# EAGLE schematic dotflipper (EAGLE 9.1.1)

## Sheet 1 of 2
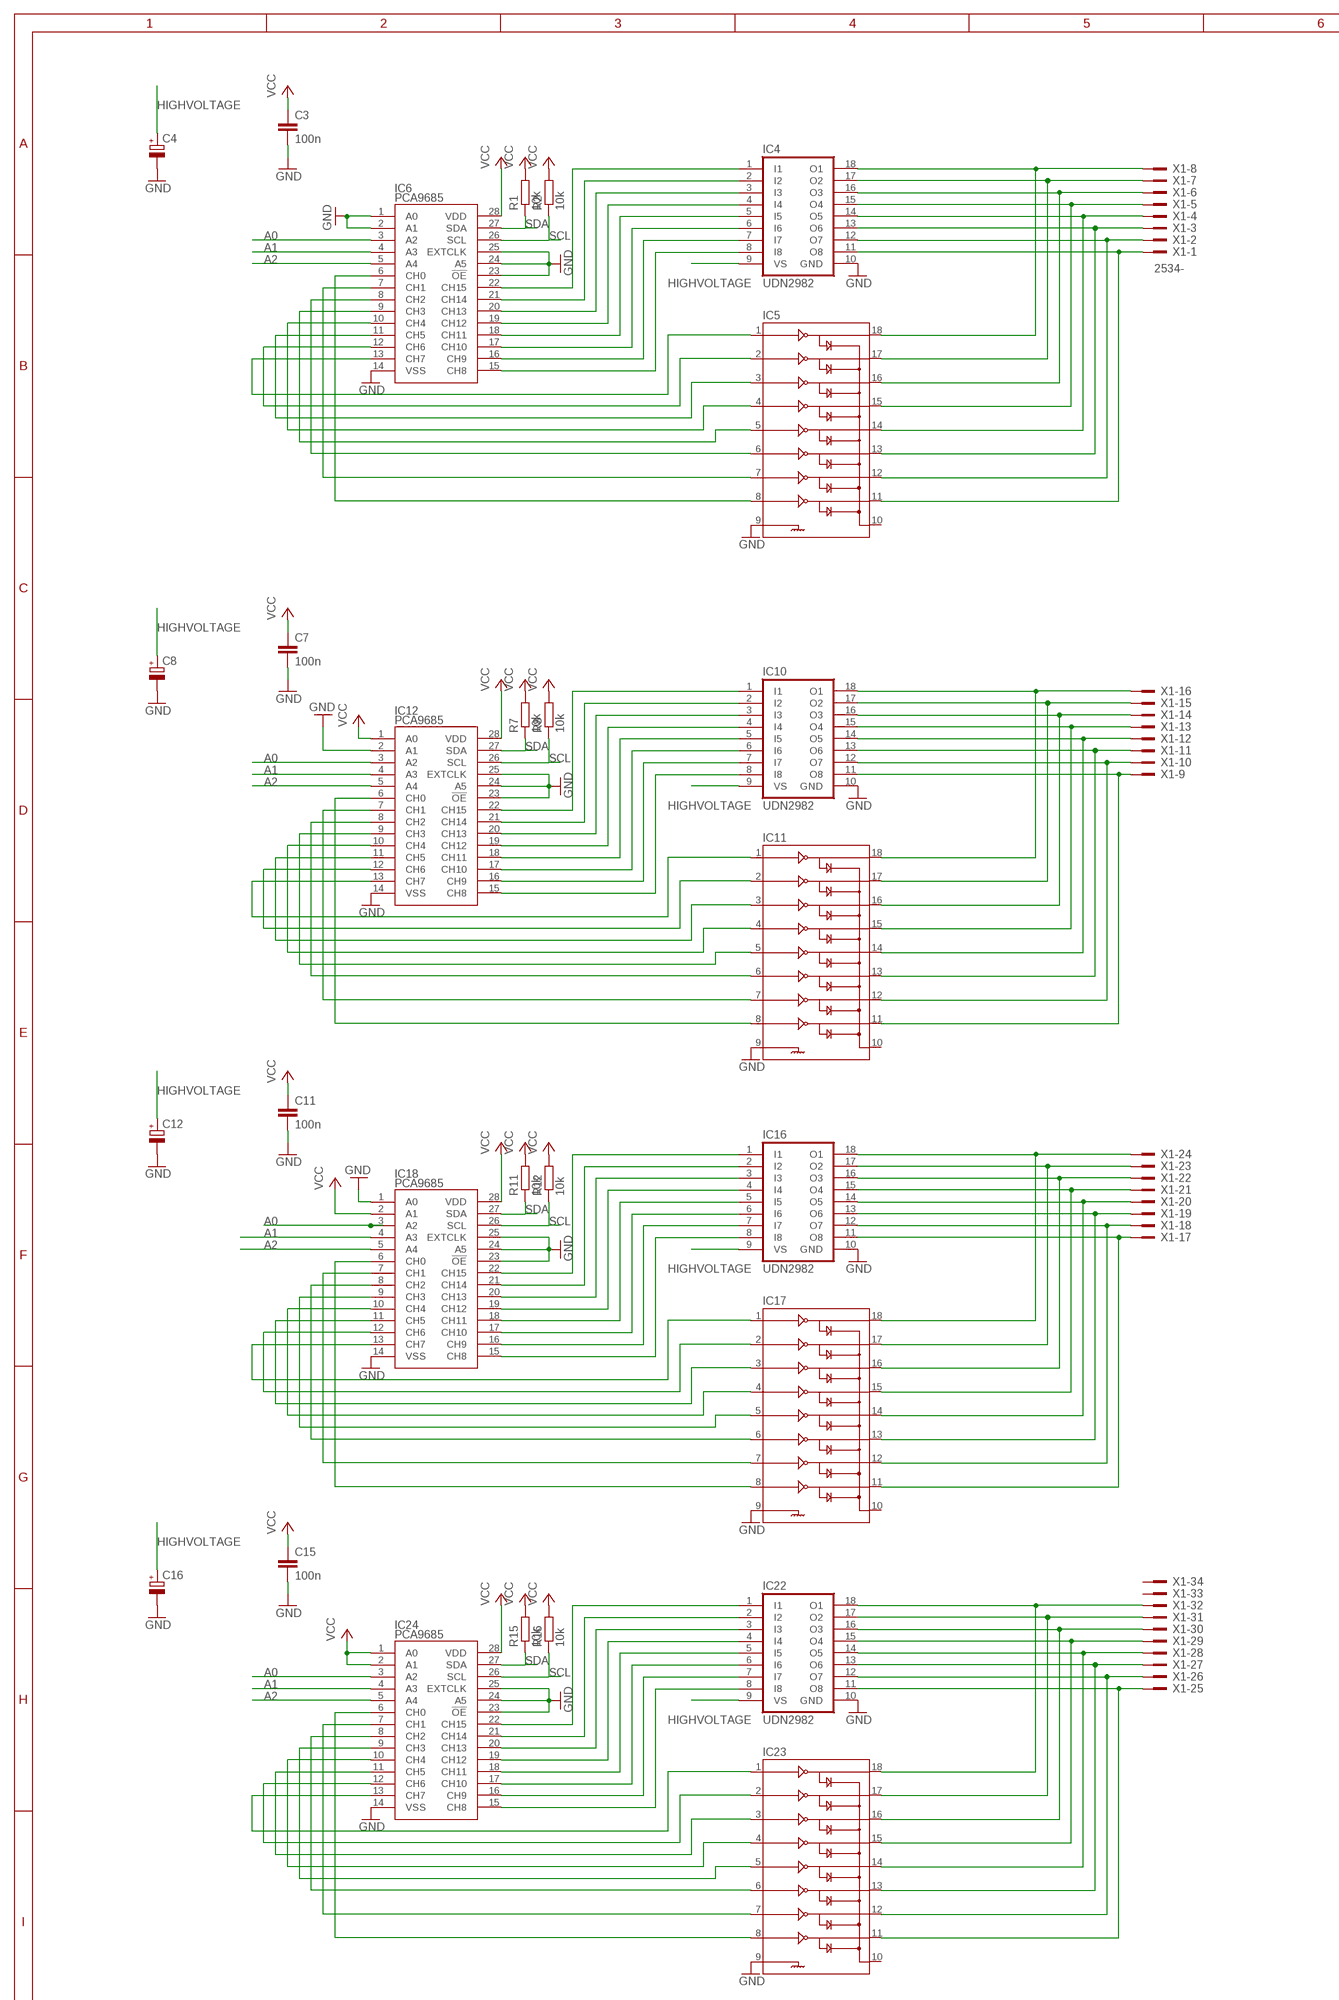
[diagram p0: schematic, sheet 1, part 1 of 2]
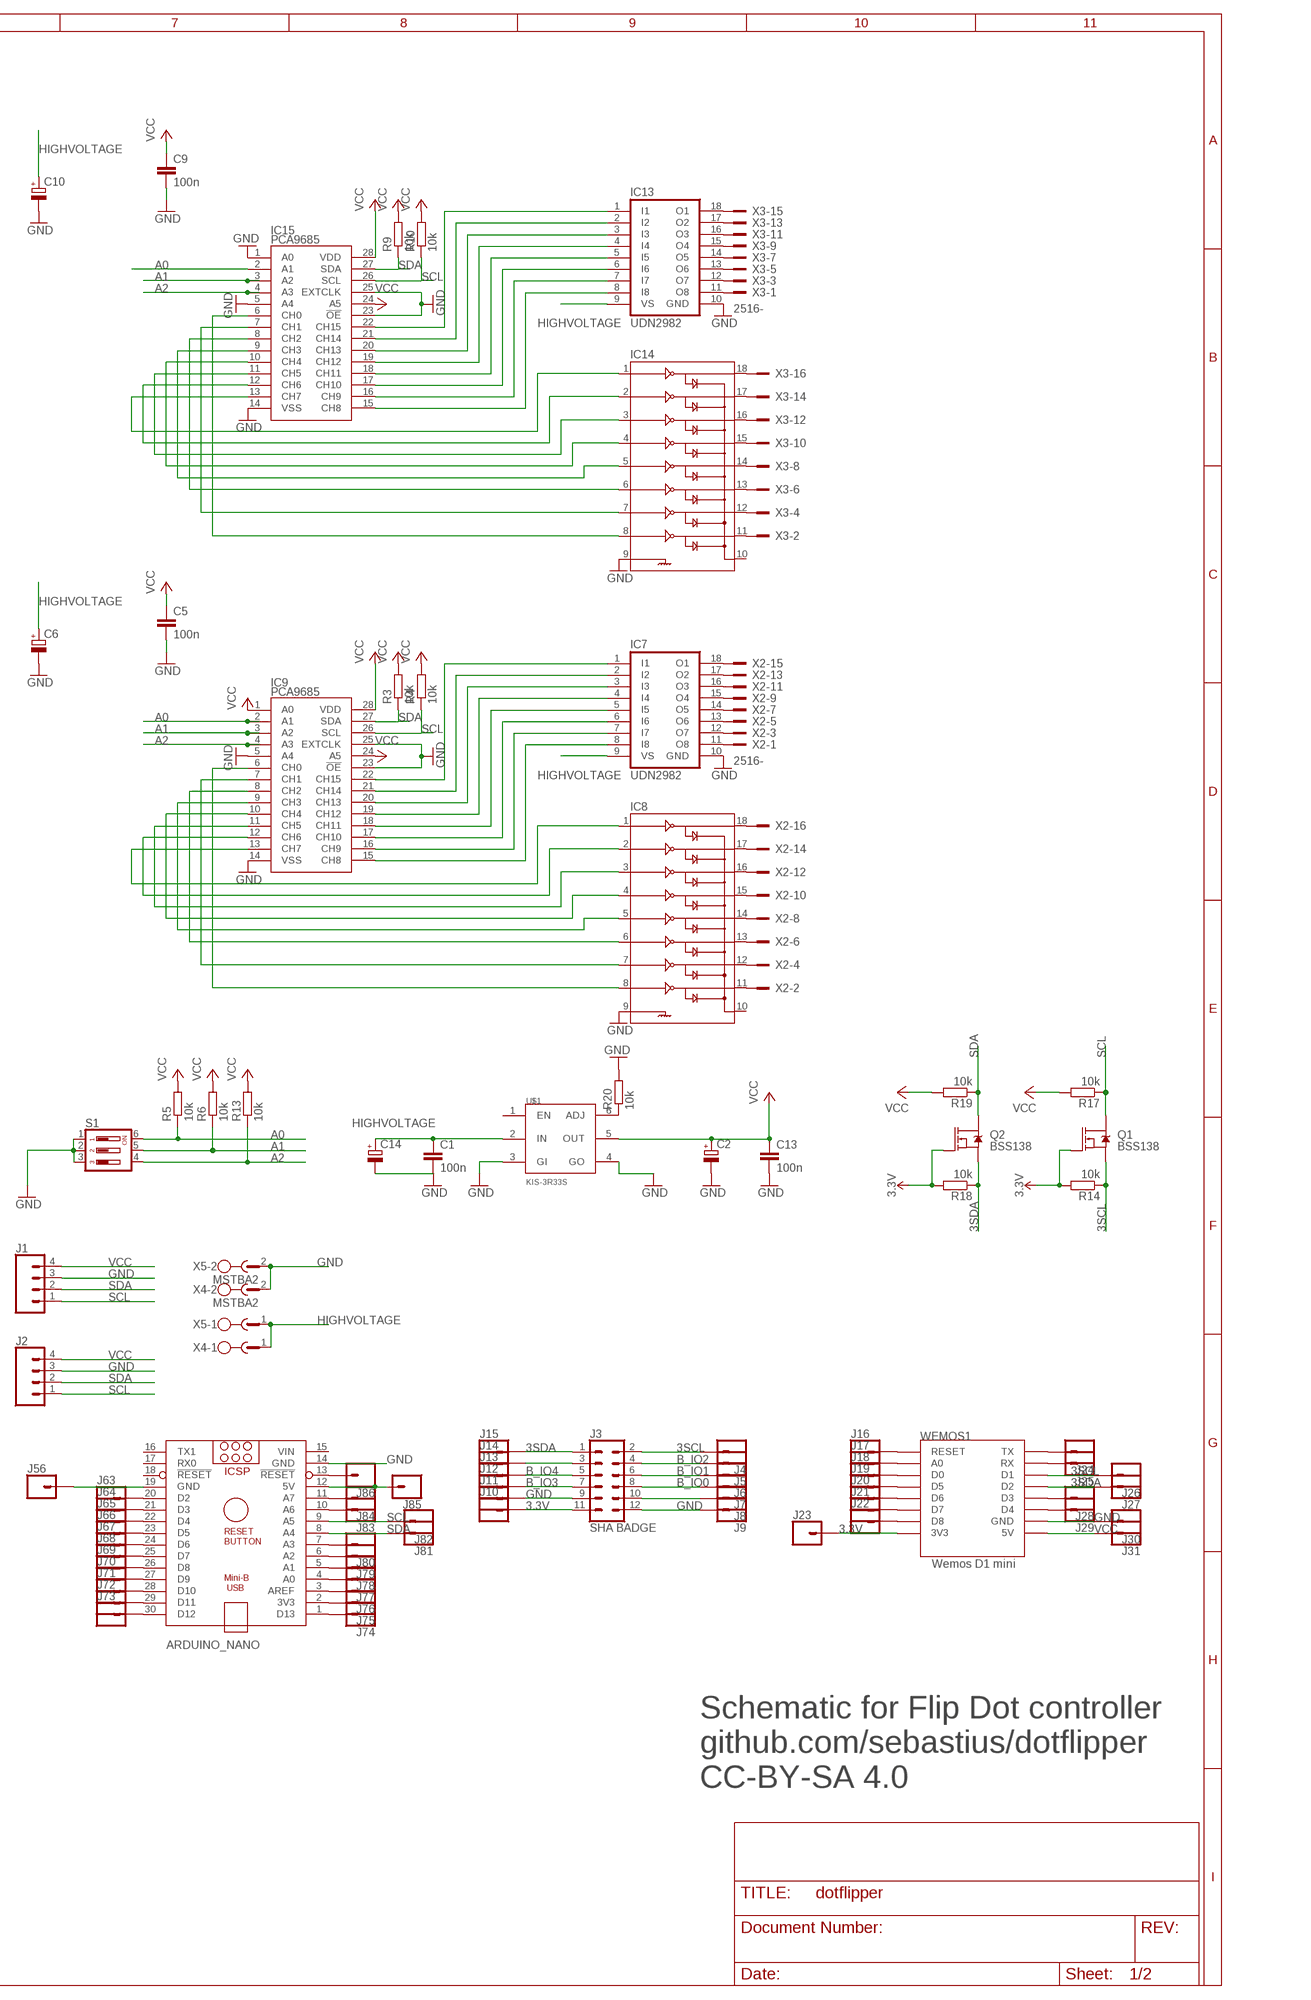
[diagram p1: schematic, sheet 1, part 2 of 2]

### Parts
ARDUINO_NANO  ARDUINO_NANO  [ARDUINO_NANO]
C1  100n  C-EUC0603  [C0603]
C2  CPOL-EUSANYO_SMD_F8  [SANYO-OSCON_SMD_F8]
C3  100n  C-EUC0603  [C0603]
C4  CPOL-EUE2.5-6  [E2,5-6]
C5  100n  C-EUC0603  [C0603]
C6  CPOL-EUE2.5-6  [E2,5-6]
C7  100n  C-EUC0603  [C0603]
C8  CPOL-EUE2.5-6  [E2,5-6]
C9  100n  C-EUC0603  [C0603]
C10  CPOL-EUE2.5-6  [E2,5-6]
C11  100n  C-EUC0603  [C0603]
C12  CPOL-EUE2.5-6  [E2,5-6]
C13  100n  C-EUC0603  [C0603]
C14  CPOL-EUSANYO_SMD_F8  [SANYO-OSCON_SMD_F8]
C15  100n  C-EUC0603  [C0603]
C16  CPOL-EUE2.5-6  [E2,5-6]
IC4  UDN2982  UDN2981A  [DIL18]
IC5  ULN2803DIP  [DIL18]
IC6  PCA9685  [TSSOP-28_4MM]
IC7  UDN2982  UDN2981A  [DIL18]
IC8  ULN2803DIP  [DIL18]
IC9  PCA9685  [TSSOP-28_4MM]
IC10  UDN2982  UDN2981A  [DIL18]
IC11  ULN2803DIP  [DIL18]
IC12  PCA9685  [TSSOP-28_4MM]
IC13  UDN2982  UDN2981A  [DIL18]
IC14  ULN2803DIP  [DIL18]
IC15  PCA9685  [TSSOP-28_4MM]
IC16  UDN2982  UDN2981A  [DIL18]
IC17  ULN2803DIP  [DIL18]
IC18  PCA9685  [TSSOP-28_4MM]
IC22  UDN2982  UDN2981A  [DIL18]
IC23  ULN2803DIP  [DIL18]
IC24  PCA9685  [TSSOP-28_4MM]
J1  CONN_04  [1X04]
J2  CONN_04  [1X04]
J3  SHA BADGE  CONN_06X2PTH_FEMALE  [2X6]
J4  CONN_01  [1X01]
J5  CONN_01  [1X01]
J6  CONN_01  [1X01]
J7  CONN_01  [1X01]
J8  CONN_01  [1X01]
J9  CONN_01  [1X01]
J10  CONN_01  [1X01]
J11  CONN_01  [1X01]
J12  CONN_01  [1X01]
J13  CONN_01  [1X01]
J14  CONN_01  [1X01]
J15  CONN_01  [1X01]
J16  CONN_01  [1X01]
J17  CONN_01  [1X01]
J18  CONN_01  [1X01]
J19  CONN_01  [1X01]
J20  CONN_01  [1X01]
J21  CONN_01  [1X01]
J22  CONN_01  [1X01]
J23  CONN_01  [1X01]
J24  CONN_01  [1X01]
J25  CONN_01  [1X01]
J26  CONN_01  [1X01]
J27  CONN_01  [1X01]
J28  CONN_01  [1X01]
J29  CONN_01  [1X01]
J30  CONN_01  [1X01]
J31  CONN_01  [1X01]
J56  CONN_01  [1X01]
J63  CONN_01  [1X01]
J64  CONN_01  [1X01]
J65  CONN_01  [1X01]
J66  CONN_01  [1X01]
J67  CONN_01  [1X01]
J68  CONN_01  [1X01]
J69  CONN_01  [1X01]
J70  CONN_01  [1X01]
J71  CONN_01  [1X01]
J72  CONN_01  [1X01]
J73  CONN_01  [1X01]
J74  CONN_01  [1X01]
J75  CONN_01  [1X01]
J76  CONN_01  [1X01]
J77  CONN_01  [1X01]
J78  CONN_01  [1X01]
J79  CONN_01  [1X01]
J80  CONN_01  [1X01]
J81  CONN_01  [1X01]
J82  CONN_01  [1X01]
J83  CONN_01  [1X01]
J84  CONN_01  [1X01]
J85  CONN_01  [1X01]
J86  CONN_01  [1X01]
Q1  BSS138  MOSFET-NCH-BSS138  [SOT23-3]
Q2  BSS138  MOSFET-NCH-BSS138  [SOT23-3]
R1  10k  R-EU_R0603  [R0603]
R2  10k  R-EU_R0603  [R0603]
R3  10k  R-EU_R0603  [R0603]
R4  10k  R-EU_R0603  [R0603]
R5  10k  R-EU_R0603  [R0603]
R6  10k  R-EU_R0603  [R0603]
R7  10k  R-EU_R0603  [R0603]
R8  10k  R-EU_R0603  [R0603]
R9  10k  R-EU_R0603  [R0603]
R10  10k  R-EU_R0603  [R0603]
R11  10k  R-EU_R0603  [R0603]
R12  10k  R-EU_R0603  [R0603]
R13  10k  R-EU_R0603  [R0603]
R14  10k  R-EU_R0603  [R0603]
R15  10k  R-EU_R0603  [R0603]
R16  10k  R-EU_R0603  [R0603]
R17  10k  R-EU_R0603  [R0603]
R18  10k  R-EU_R0603  [R0603]
R19  10k  R-EU_R0603  [R0603]
R20  10k  R-EU_R0603  [R0603]
S1  DIP03YL  [DIP03YL]
U$1  KIS-3R33S  [KIS-3R33S]
WEMOS1  Wemos D1 mini  WEMOS-D1-MINI  [WEMOS-D1-MINI]
X1  2534-  [PAK100/2500-34]
X2  2516-  [PAK100/2500-16]
X3  2516-  [PAK100/2500-16]
X4  MSTBA2  [MSTBA2]
X5  MSTBA2  [MSTBA2]

### Nets
3.3V: J3.11 J10.1 J23.1 Q1.1(G) Q2.1(G) R14.2 R18.2 WEMOS1.3V3
3SCL: J3.2 J4.1 J26.1 Q1.2(S) R14.1 WEMOS1.D1
3SDA: J3.1 J15.1 J27.1 Q2.2(S) R18.1 WEMOS1.D2
A0: IC6.3(A2) IC9.2(A1) IC12.3(A2) IC15.2(A1) IC18.3(A2) IC24.3(A2) R5.1 S1.6
A1: IC6.4(A3) IC9.3(A2) IC12.4(A3) IC15.3(A2) IC18.4(A3) IC24.4(A3) R6.1 S1.5
A2: IC6.5(A4) IC9.4(A3) IC12.5(A4) IC15.4(A3) IC18.5(A4) IC24.5(A4) R13.1 S1.4
B_IO0: J3.8 J7.1
B_IO1: J3.6 J6.1
B_IO2: J3.4 J5.1
B_IO3: J3.7 J12.1
B_IO4: J3.5 J13.1
GND: ARDUINO_NANO.14(GND) ARDUINO_NANO.19(GND) C1.2 C2.- C3.2 C4.- C5.2 C6.- C7.2 C8.- C9.2 C10.- C11.2 C12.- C13.2 C14.- C15.2 C16.- IC4.10(GND) IC5.9 IC6.1(A0) IC6.2(A1) IC6.14(VSS) IC6.23(!OE) IC6.24(A5) IC6.25(EXTCLK) IC7.10(GND) IC8.9 IC9.5(A4) IC9.14(VSS) IC9.23(!OE) IC9.25(EXTCLK) IC10.10(GND) IC11.9 IC12.2(A1) IC12.14(VSS) IC12.23(!OE) IC12.24(A5) IC12.25(EXTCLK) IC13.10(GND) IC14.9 IC15.1(A0) IC15.5(A4) IC15.14(VSS) IC15.23(!OE) IC15.25(EXTCLK) IC16.10(GND) IC17.9 IC18.1(A0) IC18.14(VSS) IC18.23(!OE) IC18.24(A5) IC18.25(EXTCLK) IC22.10(GND) IC23.9 IC24.14(VSS) IC24.23(!OE) IC24.24(A5) IC24.25(EXTCLK) J1.3 J2.3 J3.9 J3.12 J9.1 J11.1 J30.1 J56.1 R20.2 S1.1 S1.2 S1.3 U$1.3(GI) U$1.4(GO) WEMOS1.GND X4.2 X5.2
HIGHVOLTAGE: C1.1 C4.+ C6.+ C8.+ C10.+ C12.+ C14.+ C16.+ IC4.9(VS) IC7.9(VS) IC10.9(VS) IC13.9(VS) IC16.9(VS) IC22.9(VS) U$1.2(IN) X4.1 X5.1
N$1: IC4.1(I1) IC6.22(CH15)
N$2: IC4.2(I2) IC6.21(CH14)
N$3: IC4.3(I3) IC6.20(CH13)
N$4: IC4.4(I4) IC6.19(CH12)
N$5: IC7.11(O8) X2.1
N$6: IC4.5(I5) IC6.18(CH11)
N$7: IC8.11 X2.2
N$8: IC7.12(O7) X2.3
N$9: IC8.12 X2.4
N$10: IC7.13(O6) X2.5
N$11: IC7.14(O5) X2.7
N$12: IC7.15(O4) X2.9
N$13: IC7.16(O3) X2.11
N$14: IC7.17(O2) X2.13
N$15: IC7.18(O1) X2.15
N$16: IC8.13 X2.6
N$17: IC4.6(I6) IC6.17(CH10)
N$18: IC4.7(I7) IC6.16(CH9)
N$19: IC8.14 X2.8
N$20: IC4.8(I8) IC6.15(CH8)
N$21: IC5.4 IC6.10(CH4)
N$22: IC8.15 X2.10
N$23: IC8.16 X2.12
N$24: IC8.17 X2.14
N$25: IC5.6 IC6.8(CH2)
N$26: IC5.7 IC6.7(CH1)
N$27: IC8.18 X2.16
N$28: IC5.8 IC6.6(CH0)
N$29: IC5.2 IC6.12(CH6)
N$30: IC5.3 IC6.11(CH5)
N$31: IC5.5 IC6.9(CH3)
N$32: IC5.1 IC6.13(CH7)
N$33: IC13.11(O8) X3.1
N$34: IC4.12(O7) IC5.12 X1.2
N$35: IC13.12(O7) X3.3
N$36: IC4.14(O5) IC5.14 X1.4
N$37: IC13.13(O6) X3.5
N$38: IC4.16(O3) IC5.16 X1.6
N$39: IC13.14(O5) X3.7
N$40: IC13.15(O4) X3.9
N$41: IC4.18(O1) IC5.18 X1.8
N$42: IC13.16(O3) X3.11
N$43: IC4.11(O8) IC5.11 X1.1
N$44: IC13.17(O2) X3.13
N$45: IC4.13(O6) IC5.13 X1.3
N$46: IC13.18(O1) X3.15
N$47: IC4.15(O4) IC5.15 X1.5
N$48: IC4.17(O2) IC5.17 X1.7
N$49: IC7.1(I1) IC9.22(CH15)
N$50: IC7.2(I2) IC9.21(CH14)
N$51: IC7.3(I3) IC9.20(CH13)
N$52: IC7.4(I4) IC9.19(CH12)
N$53: IC7.5(I5) IC9.18(CH11)
N$54: IC7.6(I6) IC9.17(CH10)
N$55: IC7.7(I7) IC9.16(CH9)
N$56: IC7.8(I8) IC9.15(CH8)
N$57: IC8.4 IC9.10(CH4)
N$58: IC8.6 IC9.8(CH2)
N$59: IC8.7 IC9.7(CH1)
N$60: IC8.8 IC9.6(CH0)
N$61: IC8.2 IC9.12(CH6)
N$62: IC8.3 IC9.11(CH5)
N$63: IC8.5 IC9.9(CH3)
N$64: IC8.1 IC9.13(CH7)
N$65: IC14.11 X3.2
N$66: IC14.12 X3.4
N$67: IC14.13 X3.6
N$68: IC14.14 X3.8
N$69: IC14.15 X3.10
N$70: IC14.16 X3.12
N$71: IC14.17 X3.14
N$72: IC14.18 X3.16
N$73: IC10.1(I1) IC12.22(CH15)
N$74: IC10.2(I2) IC12.21(CH14)
N$75: IC10.3(I3) IC12.20(CH13)
N$76: IC10.4(I4) IC12.19(CH12)
N$77: IC10.5(I5) IC12.18(CH11)
N$78: IC10.6(I6) IC12.17(CH10)
N$79: IC10.7(I7) IC12.16(CH9)
N$80: IC10.8(I8) IC12.15(CH8)
N$81: IC11.4 IC12.10(CH4)
N$82: IC11.6 IC12.8(CH2)
N$83: IC11.7 IC12.7(CH1)
N$84: IC11.8 IC12.6(CH0)
N$85: IC11.2 IC12.12(CH6)
N$86: IC11.3 IC12.11(CH5)
N$87: IC11.5 IC12.9(CH3)
N$88: IC11.1 IC12.13(CH7)
N$89: IC10.12(O7) IC11.12 X1.10
N$90: IC10.14(O5) IC11.14 X1.12
N$91: IC10.16(O3) IC11.16 X1.14
N$92: IC10.18(O1) IC11.18 X1.16
N$93: IC10.11(O8) IC11.11 X1.9
N$94: IC10.13(O6) IC11.13 X1.11
N$95: IC10.15(O4) IC11.15 X1.13
N$96: IC10.17(O2) IC11.17 X1.15
N$97: J16.1 WEMOS1.RESET
N$98: J17.1 WEMOS1.A0
N$99: J3.3 J14.1
N$100: R20.1 U$1.6(ADJ)
N$101: J18.1 WEMOS1.D0
N$102: J19.1 WEMOS1.D5
N$103: J20.1 WEMOS1.D6
N$104: J21.1 WEMOS1.D7
N$105: IC13.1(I1) IC15.22(CH15)
N$106: IC13.2(I2) IC15.21(CH14)
N$107: IC13.3(I3) IC15.20(CH13)
N$108: IC13.4(I4) IC15.19(CH12)
N$109: IC13.5(I5) IC15.18(CH11)
N$110: IC13.6(I6) IC15.17(CH10)
N$111: IC13.7(I7) IC15.16(CH9)
N$112: IC13.8(I8) IC15.15(CH8)
N$113: IC14.4 IC15.10(CH4)
N$114: IC14.6 IC15.8(CH2)
N$115: IC14.7 IC15.7(CH1)
N$116: IC14.8 IC15.6(CH0)
N$117: IC14.2 IC15.12(CH6)
N$118: IC14.3 IC15.11(CH5)
N$119: IC14.5 IC15.9(CH3)
N$120: IC14.1 IC15.13(CH7)
N$121: IC16.1(I1) IC18.22(CH15)
N$122: IC16.2(I2) IC18.21(CH14)
N$123: IC16.3(I3) IC18.20(CH13)
N$124: IC16.4(I4) IC18.19(CH12)
N$125: IC16.5(I5) IC18.18(CH11)
N$126: IC16.6(I6) IC18.17(CH10)
N$127: IC16.7(I7) IC18.16(CH9)
N$128: IC16.8(I8) IC18.15(CH8)
N$129: IC17.4 IC18.10(CH4)
N$130: IC17.6 IC18.8(CH2)
N$131: IC17.7 IC18.7(CH1)
N$132: IC17.8 IC18.6(CH0)
N$133: IC17.2 IC18.12(CH6)
N$134: IC17.3 IC18.11(CH5)
N$135: IC17.5 IC18.9(CH3)
N$136: IC17.1 IC18.13(CH7)
N$137: IC16.12(O7) IC17.12 X1.18
N$138: IC16.14(O5) IC17.14 X1.20
N$139: IC16.16(O3) IC17.16 X1.22
N$140: IC16.18(O1) IC17.18 X1.24
N$141: IC16.11(O8) IC17.11 X1.17
N$142: IC16.13(O6) IC17.13 X1.19
N$143: IC16.15(O4) IC17.15 X1.21
N$144: IC16.17(O2) IC17.17 X1.23
N$145: J22.1 WEMOS1.D8
N$146: J24.1 WEMOS1.TX
N$147: J3.10 J8.1
N$148: J25.1 WEMOS1.RX
N$149: J28.1 WEMOS1.D3
N$150: J29.1 WEMOS1.D4
N$152: ARDUINO_NANO.20(D2) J63.1
N$153: ARDUINO_NANO.21(D3) J64.1
N$154: ARDUINO_NANO.22(D4) J65.1
N$155: ARDUINO_NANO.23(D5) J66.1
N$156: ARDUINO_NANO.24(D6) J67.1
N$157: ARDUINO_NANO.25(D7) J68.1
N$158: ARDUINO_NANO.26(D8) J69.1
N$159: ARDUINO_NANO.27(D9) J70.1
N$160: ARDUINO_NANO.28(D10) J71.1
N$161: ARDUINO_NANO.29(D11) J72.1
N$162: ARDUINO_NANO.30(D12) J73.1
N$163: ARDUINO_NANO.1(D13) J74.1
N$164: ARDUINO_NANO.2(3V3) J75.1
N$165: ARDUINO_NANO.3(AREF) J76.1
N$166: ARDUINO_NANO.4(A0) J77.1
N$167: ARDUINO_NANO.5(A1) J78.1
N$168: ARDUINO_NANO.6(A2) J79.1
N$169: IC22.1(I1) IC24.22(CH15)
N$170: IC22.2(I2) IC24.21(CH14)
N$171: IC22.3(I3) IC24.20(CH13)
N$172: IC22.4(I4) IC24.19(CH12)
N$173: IC22.5(I5) IC24.18(CH11)
N$174: IC22.6(I6) IC24.17(CH10)
N$175: IC22.7(I7) IC24.16(CH9)
N$176: IC22.8(I8) IC24.15(CH8)
N$177: IC23.4 IC24.10(CH4)
N$178: IC23.6 IC24.8(CH2)
N$179: IC23.7 IC24.7(CH1)
N$180: IC23.8 IC24.6(CH0)
N$181: IC23.2 IC24.12(CH6)
N$182: IC23.3 IC24.11(CH5)
N$183: IC23.5 IC24.9(CH3)
N$184: IC23.1 IC24.13(CH7)
N$185: IC22.12(O7) IC23.12 X1.26
N$186: IC22.14(O5) IC23.14 X1.28
N$187: IC22.16(O3) IC23.16 X1.30
N$188: IC22.18(O1) IC23.18 X1.32
N$189: IC22.11(O8) IC23.11 X1.25
N$190: IC22.13(O6) IC23.13 X1.27
N$191: IC22.15(O4) IC23.15 X1.29
N$192: IC22.17(O2) IC23.17 X1.31
N$193: ARDUINO_NANO.7(A3) J80.1
N$194: ARDUINO_NANO.10(A6) J83.1
N$195: ARDUINO_NANO.11(A7) J84.1
N$196: ARDUINO_NANO.13(!RESET) J86.1
SCL: ARDUINO_NANO.9(A5) IC6.26(SCL) IC9.26(SCL) IC12.26(SCL) IC15.26(SCL) IC18.26(SCL) IC24.26(SCL) J1.1 J2.1 J82.1 Q1.3(D) R2.1 R4.1 R8.1 R10.1 R12.1 R16.1 R17.1
SDA: ARDUINO_NANO.8(A4) IC6.27(SDA) IC9.27(SDA) IC12.27(SDA) IC15.27(SDA) IC18.27(SDA) IC24.27(SDA) J1.2 J2.2 J81.1 Q2.3(D) R1.1 R3.1 R7.1 R9.1 R11.1 R15.1 R19.1
VCC: ARDUINO_NANO.12(5V) C2.+ C3.1 C5.1 C7.1 C9.1 C11.1 C13.1 C15.1 IC6.28(VDD) IC9.1(A0) IC9.24(A5) IC9.28(VDD) IC12.1(A0) IC12.28(VDD) IC15.24(A5) IC15.28(VDD) IC18.2(A1) IC18.28(VDD) IC24.1(A0) IC24.2(A1) IC24.28(VDD) J1.4 J2.4 J31.1 J85.1 R1.2 R2.2 R3.2 R4.2 R5.2 R6.2 R7.2 R8.2 R9.2 R10.2 R11.2 R12.2 R13.2 R15.2 R16.2 R17.2 R19.2 U$1.5(OUT) WEMOS1.5V
Unconnected: ARDUINO_NANO.16(TX1) ARDUINO_NANO.17(RX0) ARDUINO_NANO.18(!RESET) IC5.10 IC8.10 IC11.10 IC14.10 IC17.10 IC23.10 U$1.1(EN) X1.33 X1.34

### Notes on the sheet
- Schematic for Flip Dot controller
  github.com/sebastius/dotflipper
  CC-BY-SA 4.0

## Sheet 2 of 2
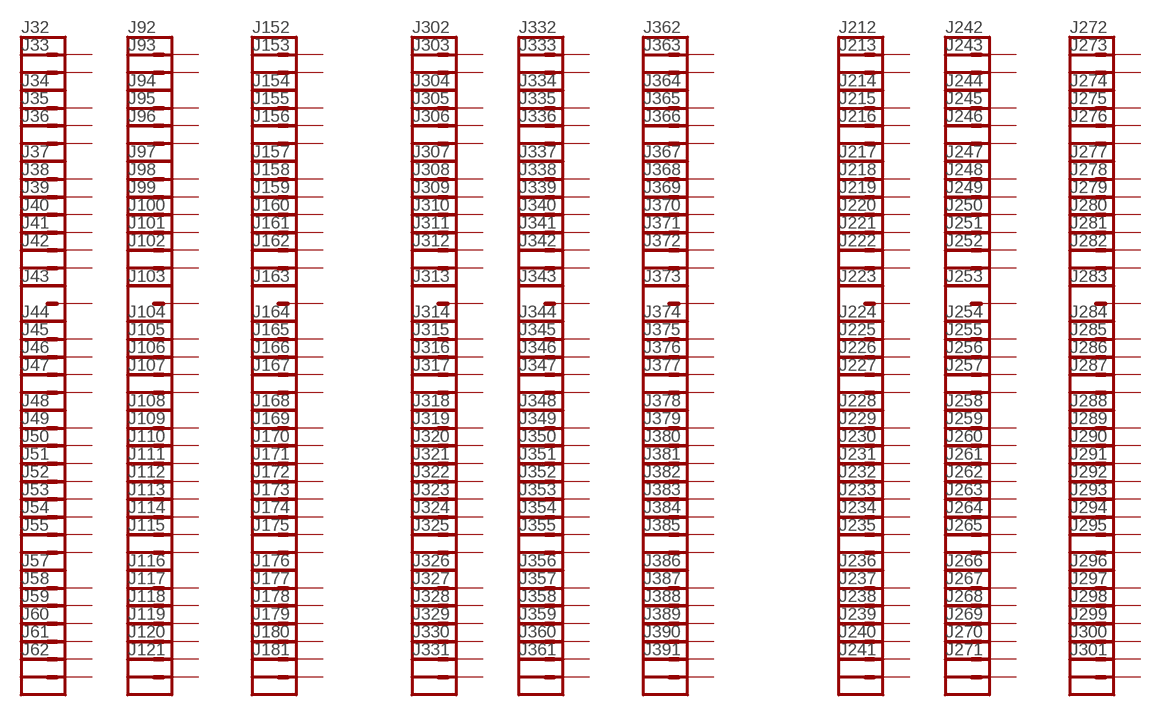
[diagram p2: schematic, sheet 2]

### Parts
J32  CONN_01  [1X01]
J33  CONN_01  [1X01]
J34  CONN_01  [1X01]
J35  CONN_01  [1X01]
J36  CONN_01  [1X01]
J37  CONN_01  [1X01]
J38  CONN_01  [1X01]
J39  CONN_01  [1X01]
J40  CONN_01  [1X01]
J41  CONN_01  [1X01]
J42  CONN_01  [1X01]
J43  CONN_01  [1X01]
J44  CONN_01  [1X01]
J45  CONN_01  [1X01]
J46  CONN_01  [1X01]
J47  CONN_01  [1X01]
J48  CONN_01  [1X01]
J49  CONN_01  [1X01]
J50  CONN_01  [1X01]
J51  CONN_01  [1X01]
J52  CONN_01  [1X01]
J53  CONN_01  [1X01]
J54  CONN_01  [1X01]
J55  CONN_01  [1X01]
J57  CONN_01  [1X01]
J58  CONN_01  [1X01]
J59  CONN_01  [1X01]
J60  CONN_01  [1X01]
J61  CONN_01  [1X01]
J62  CONN_01  [1X01]
J92  CONN_01  [1X01]
J93  CONN_01  [1X01]
J94  CONN_01  [1X01]
J95  CONN_01  [1X01]
J96  CONN_01  [1X01]
J97  CONN_01  [1X01]
J98  CONN_01  [1X01]
J99  CONN_01  [1X01]
J100  CONN_01  [1X01]
J101  CONN_01  [1X01]
J102  CONN_01  [1X01]
J103  CONN_01  [1X01]
J104  CONN_01  [1X01]
J105  CONN_01  [1X01]
J106  CONN_01  [1X01]
J107  CONN_01  [1X01]
J108  CONN_01  [1X01]
J109  CONN_01  [1X01]
J110  CONN_01  [1X01]
J111  CONN_01  [1X01]
J112  CONN_01  [1X01]
J113  CONN_01  [1X01]
J114  CONN_01  [1X01]
J115  CONN_01  [1X01]
J116  CONN_01  [1X01]
J117  CONN_01  [1X01]
J118  CONN_01  [1X01]
J119  CONN_01  [1X01]
J120  CONN_01  [1X01]
J121  CONN_01  [1X01]
J152  CONN_01  [1X01]
J153  CONN_01  [1X01]
J154  CONN_01  [1X01]
J155  CONN_01  [1X01]
J156  CONN_01  [1X01]
J157  CONN_01  [1X01]
J158  CONN_01  [1X01]
J159  CONN_01  [1X01]
J160  CONN_01  [1X01]
J161  CONN_01  [1X01]
J162  CONN_01  [1X01]
J163  CONN_01  [1X01]
J164  CONN_01  [1X01]
J165  CONN_01  [1X01]
J166  CONN_01  [1X01]
J167  CONN_01  [1X01]
J168  CONN_01  [1X01]
J169  CONN_01  [1X01]
J170  CONN_01  [1X01]
J171  CONN_01  [1X01]
J172  CONN_01  [1X01]
J173  CONN_01  [1X01]
J174  CONN_01  [1X01]
J175  CONN_01  [1X01]
J176  CONN_01  [1X01]
J177  CONN_01  [1X01]
J178  CONN_01  [1X01]
J179  CONN_01  [1X01]
J180  CONN_01  [1X01]
J181  CONN_01  [1X01]
J212  CONN_01  [1X01]
J213  CONN_01  [1X01]
J214  CONN_01  [1X01]
J215  CONN_01  [1X01]
J216  CONN_01  [1X01]
J217  CONN_01  [1X01]
J218  CONN_01  [1X01]
J219  CONN_01  [1X01]
J220  CONN_01  [1X01]
J221  CONN_01  [1X01]
J222  CONN_01  [1X01]
J223  CONN_01  [1X01]
J224  CONN_01  [1X01]
J225  CONN_01  [1X01]
J226  CONN_01  [1X01]
J227  CONN_01  [1X01]
J228  CONN_01  [1X01]
J229  CONN_01  [1X01]
J230  CONN_01  [1X01]
J231  CONN_01  [1X01]
J232  CONN_01  [1X01]
J233  CONN_01  [1X01]
J234  CONN_01  [1X01]
J235  CONN_01  [1X01]
J236  CONN_01  [1X01]
J237  CONN_01  [1X01]
J238  CONN_01  [1X01]
J239  CONN_01  [1X01]
J240  CONN_01  [1X01]
J241  CONN_01  [1X01]
J242  CONN_01  [1X01]
J243  CONN_01  [1X01]
J244  CONN_01  [1X01]
J245  CONN_01  [1X01]
J246  CONN_01  [1X01]
J247  CONN_01  [1X01]
J248  CONN_01  [1X01]
J249  CONN_01  [1X01]
J250  CONN_01  [1X01]
J251  CONN_01  [1X01]
J252  CONN_01  [1X01]
J253  CONN_01  [1X01]
J254  CONN_01  [1X01]
J255  CONN_01  [1X01]
J256  CONN_01  [1X01]
J257  CONN_01  [1X01]
J258  CONN_01  [1X01]
J259  CONN_01  [1X01]
J260  CONN_01  [1X01]
J261  CONN_01  [1X01]
J262  CONN_01  [1X01]
J263  CONN_01  [1X01]
J264  CONN_01  [1X01]
J265  CONN_01  [1X01]
J266  CONN_01  [1X01]
J267  CONN_01  [1X01]
J268  CONN_01  [1X01]
J269  CONN_01  [1X01]
J270  CONN_01  [1X01]
J271  CONN_01  [1X01]
J272  CONN_01  [1X01]
J273  CONN_01  [1X01]
J274  CONN_01  [1X01]
J275  CONN_01  [1X01]
J276  CONN_01  [1X01]
J277  CONN_01  [1X01]
J278  CONN_01  [1X01]
J279  CONN_01  [1X01]
J280  CONN_01  [1X01]
J281  CONN_01  [1X01]
J282  CONN_01  [1X01]
J283  CONN_01  [1X01]
J284  CONN_01  [1X01]
J285  CONN_01  [1X01]
J286  CONN_01  [1X01]
J287  CONN_01  [1X01]
J288  CONN_01  [1X01]
J289  CONN_01  [1X01]
J290  CONN_01  [1X01]
J291  CONN_01  [1X01]
J292  CONN_01  [1X01]
J293  CONN_01  [1X01]
J294  CONN_01  [1X01]
J295  CONN_01  [1X01]
J296  CONN_01  [1X01]
J297  CONN_01  [1X01]
J298  CONN_01  [1X01]
J299  CONN_01  [1X01]
J300  CONN_01  [1X01]
J301  CONN_01  [1X01]
J302  CONN_01  [1X01]
J303  CONN_01  [1X01]
J304  CONN_01  [1X01]
J305  CONN_01  [1X01]
J306  CONN_01  [1X01]
J307  CONN_01  [1X01]
J308  CONN_01  [1X01]
J309  CONN_01  [1X01]
J310  CONN_01  [1X01]
J311  CONN_01  [1X01]
J312  CONN_01  [1X01]
J313  CONN_01  [1X01]
J314  CONN_01  [1X01]
J315  CONN_01  [1X01]
J316  CONN_01  [1X01]
J317  CONN_01  [1X01]
J318  CONN_01  [1X01]
J319  CONN_01  [1X01]
J320  CONN_01  [1X01]
J321  CONN_01  [1X01]
J322  CONN_01  [1X01]
J323  CONN_01  [1X01]
J324  CONN_01  [1X01]
J325  CONN_01  [1X01]
J326  CONN_01  [1X01]
J327  CONN_01  [1X01]
J328  CONN_01  [1X01]
J329  CONN_01  [1X01]
J330  CONN_01  [1X01]
J331  CONN_01  [1X01]
J332  CONN_01  [1X01]
J333  CONN_01  [1X01]
J334  CONN_01  [1X01]
J335  CONN_01  [1X01]
J336  CONN_01  [1X01]
J337  CONN_01  [1X01]
J338  CONN_01  [1X01]
J339  CONN_01  [1X01]
J340  CONN_01  [1X01]
J341  CONN_01  [1X01]
J342  CONN_01  [1X01]
J343  CONN_01  [1X01]
J344  CONN_01  [1X01]
J345  CONN_01  [1X01]
J346  CONN_01  [1X01]
J347  CONN_01  [1X01]
J348  CONN_01  [1X01]
J349  CONN_01  [1X01]
J350  CONN_01  [1X01]
J351  CONN_01  [1X01]
J352  CONN_01  [1X01]
J353  CONN_01  [1X01]
J354  CONN_01  [1X01]
J355  CONN_01  [1X01]
J356  CONN_01  [1X01]
J357  CONN_01  [1X01]
J358  CONN_01  [1X01]
J359  CONN_01  [1X01]
J360  CONN_01  [1X01]
J361  CONN_01  [1X01]
J362  CONN_01  [1X01]
J363  CONN_01  [1X01]
J364  CONN_01  [1X01]
J365  CONN_01  [1X01]
J366  CONN_01  [1X01]
J367  CONN_01  [1X01]
J368  CONN_01  [1X01]
J369  CONN_01  [1X01]
J370  CONN_01  [1X01]
J371  CONN_01  [1X01]
J372  CONN_01  [1X01]
J373  CONN_01  [1X01]
J374  CONN_01  [1X01]
J375  CONN_01  [1X01]
J376  CONN_01  [1X01]
J377  CONN_01  [1X01]
J378  CONN_01  [1X01]
J379  CONN_01  [1X01]
J380  CONN_01  [1X01]
J381  CONN_01  [1X01]
J382  CONN_01  [1X01]
J383  CONN_01  [1X01]
J384  CONN_01  [1X01]
J385  CONN_01  [1X01]
J386  CONN_01  [1X01]
J387  CONN_01  [1X01]
J388  CONN_01  [1X01]
J389  CONN_01  [1X01]
J390  CONN_01  [1X01]
J391  CONN_01  [1X01]
Unconnected: J32.1 J33.1 J34.1 J35.1 J36.1 J37.1 J38.1 J39.1 J40.1 J41.1 J42.1 J43.1 J44.1 J45.1 J46.1 J47.1 J48.1 J49.1 J50.1 J51.1 J52.1 J53.1 J54.1 J55.1 J57.1 J58.1 J59.1 J60.1 J61.1 J62.1 J92.1 J93.1 J94.1 J95.1 J96.1 J97.1 J98.1 J99.1 J100.1 J101.1 J102.1 J103.1 J104.1 J105.1 J106.1 J107.1 J108.1 J109.1 J110.1 J111.1 J112.1 J113.1 J114.1 J115.1 J116.1 J117.1 J118.1 J119.1 J120.1 J121.1 J152.1 J153.1 J154.1 J155.1 J156.1 J157.1 J158.1 J159.1 J160.1 J161.1 J162.1 J163.1 J164.1 J165.1 J166.1 J167.1 J168.1 J169.1 J170.1 J171.1 J172.1 J173.1 J174.1 J175.1 J176.1 J177.1 J178.1 J179.1 J180.1 J181.1 J212.1 J213.1 J214.1 J215.1 J216.1 J217.1 J218.1 J219.1 J220.1 J221.1 J222.1 J223.1 J224.1 J225.1 J226.1 J227.1 J228.1 J229.1 J230.1 J231.1 J232.1 J233.1 J234.1 J235.1 J236.1 J237.1 J238.1 J239.1 J240.1 J241.1 J242.1 J243.1 J244.1 J245.1 J246.1 J247.1 J248.1 J249.1 J250.1 J251.1 J252.1 J253.1 J254.1 J255.1 J256.1 J257.1 J258.1 J259.1 J260.1 J261.1 J262.1 J263.1 J264.1 J265.1 J266.1 J267.1 J268.1 J269.1 J270.1 J271.1 J272.1 J273.1 J274.1 J275.1 J276.1 J277.1 J278.1 J279.1 J280.1 J281.1 J282.1 J283.1 J284.1 J285.1 J286.1 J287.1 J288.1 J289.1 J290.1 J291.1 J292.1 J293.1 J294.1 J295.1 J296.1 J297.1 J298.1 J299.1 J300.1 J301.1 J302.1 J303.1 J304.1 J305.1 J306.1 J307.1 J308.1 J309.1 J310.1 J311.1 J312.1 J313.1 J314.1 J315.1 J316.1 J317.1 J318.1 J319.1 J320.1 J321.1 J322.1 J323.1 J324.1 J325.1 J326.1 J327.1 J328.1 J329.1 J330.1 J331.1 J332.1 J333.1 J334.1 J335.1 J336.1 J337.1 J338.1 J339.1 J340.1 J341.1 J342.1 J343.1 J344.1 J345.1 J346.1 J347.1 J348.1 J349.1 J350.1 J351.1 J352.1 J353.1 J354.1 J355.1 J356.1 J357.1 J358.1 J359.1 J360.1 J361.1 J362.1 J363.1 J364.1 J365.1 J366.1 J367.1 J368.1 J369.1 J370.1 J371.1 J372.1 J373.1 J374.1 J375.1 J376.1 J377.1 J378.1 J379.1 J380.1 J381.1 J382.1 J383.1 J384.1 J385.1 J386.1 J387.1 J388.1 J389.1 J390.1 J391.1

## Power pins joined to a net without a drawn wire
VIN: ARDUINO_NANO.15(VIN)

## Library data of the parts
ARDUINO_NANO = ArduinoNanoV30:ARDUINO_NANO: Arduino Nano V3.0 Overview: The Arduino Nano is a small, complete, and breadboard-friendly board based on the ATmega328 (Arduino Nano 3.x) or ATmega168 (Arduino Nano 2.x). It has more or less the same functionality of the Arduino Duemilanove, but in a different package. It lacks only a DC power jack, and works with a Mini-B USB cable instead of a standard one. The Nano was designed and is being produced by Gravitech. Specifications: Microcontroller Atmel ATmega168 or ATmega328 Operating Voltage (logic level) 5 V Input Voltage (recommended) 7-12 V Input Voltage (limits) 6-20 V Digital I/O Pins 14 (of which 6 provide PWM output) Analog Input Pins 8 DC Current per I/O Pin 40 mA Flash Memory 16 KB (ATmega168) or 32 KB (ATmega328) of which 2 KB used by bootloader SRAM 1 KB (ATmega168) or 2 KB (ATmega328) EEPROM 512 bytes (ATmega168) or 1 KB (ATmega328) Clock Speed 16 MHz Dimensions 0.73" x 1.70" Length 45 mm Width 18 mm Weigth 5 g Power: The Arduino Nano can be powered via the Mini-B USB connection, 6-20V unregulated external power supply (pin 30), or 5V regulated external power supply (pin 27). The power source is automatically selected to the highest voltage source. Memory: The ATmega168 has 16 KB of flash memory for storing code (of which 2 KB is used for the bootloader); the ATmega328 has 32 KB, (also with 2 KB used for the bootloader). The ATmega168 has 1 KB of SRAM and 512 bytes of EEPROM (which can be read and written with the EEPROM library); the ATmega328 has 2 KB of SRAM and 1 KB of EEPROM. Input and Output: Each of the 14 digital pins on the Nano can be used as an input or output, using pinMode(), digitalWrite(), and digitalRead() functions. They operate at 5 volts. Each pin can provide or receive a maximum of 40 mA and has an internal pull-up resistor (disconnected by default) of 20-50 kOhms. In addition, some pins have specialized functions. Visit Arduino - ArduinoBoardNano <https://www.arduino.cc/en/Main/ArduinoBoardNano>
C1 C3 C5 C7 C9 C11 C13 C15 = rcl:C-EU: CAPACITOR, European symbol
C2 C4 C6 C8 C10 C12 C14 C16 = rcl:CPOL-EU: POLARIZED CAPACITOR, European symbol
IC4 IC7 IC10 IC13 IC16 IC22 = uln-udn:UDN298*: DRIVER ARRAY Source: Allegro Microsystems Inc. / UDN2981-UDN2984.pdf
IC5 IC8 IC11 IC14 IC17 IC23 = SparkFun-IC-Special-Function:ULN2803: Darlington Driver(IC-07959, low stock) ULN2803 Darlington array. 500mA max per channel, 8-channel package. Spark Fun Electronics SKU : COM-00312
IC6 IC9 IC12 IC15 IC18 IC24 = SparkFun-IC-Special-Function:PCA9685: 16-channel 12-bit PWM I2C interface Internal Oscillator 40Hz to 1kHz Can be totem pole or open collector 2.3V to 5.5V SparkFun Products SparkFun Block for Intel® Edison - PWM <https://www.sparkfun.com/products/13042> (DEV-13042) PROTO: IC-12240 PROD_ID: IC-12271; PROD_ID: IC-12271
J1 J2 = SparkFun-Connectors:CONN_04: Multi connection point. Often used as Generic Header-pin footprint for 0.1 inch spaced/style header connections On any of the 0.1 inch spaced packages, you can populate with these: Break Away Headers - Straight <https://www.sparkfun.com/products/116> (PRT-00116) Break Away Male Headers - Right Angle <https://www.sparkfun.com/products/553> (PRT-00553) Female Headers <https://www.sparkfun.com/products/115> (PRT-00115) Break Away Headers - Machine Pin <https://www.sparkfun.com/products/117> (PRT-00117) Break Away Female Headers - Swiss Machine Pin <https://www.sparkfun.com/products/743> (PRT-00743) For SCREWTERMINALS and SPRING TERMINALS visit here: Screw Terimnals on SparkFun.com <https://www.sparkfun.com/search/results?term=Screw+Terminals> (5mm/3.5mm/2.54mm spacing) This device is also useful as a general connection point to wire up your design to another part of your project. Our various solder wires solder well into these plated through hole pads. Hook-Up Wire - Assortment (Stranded, 22 AWG) <https://www.sparkfun.com/products/11375> (PRT-11375) Hook-Up Wire - Assortment (Solid Core, 22 AWG) <https://www.sparkfun.com/products/11367> (PRT-11367) View the entire wire category on our website here <https://www.sparkfun.com/categories/141> Special notes: Molex polarized connector foot print use with SKU : PRT-08231 with associated crimp pins and housings. 1MM SMD Version SKU: PRT-10208; PROD_ID: CONN-09696
J3 = SparkFun-Connectors:CONN_06X2: Multi connection point. Often used as Generic Header-pin footprint for 0.1 inch spaced/style header connections On any of the 0.1 inch spaced packages, you can populate with these: Break Away Headers - Straight <https://www.sparkfun.com/products/116> (PRT-00116) Break Away Male Headers - Right Angle <https://www.sparkfun.com/products/553> (PRT-00553) Female Headers <https://www.sparkfun.com/products/115> (PRT-00115) Break Away Headers - Machine Pin <https://www.sparkfun.com/products/117> (PRT-00117) Break Away Female Headers - Swiss Machine Pin <https://www.sparkfun.com/products/743> (PRT-00743); PROD_ID: CONN-12423; VALUE: 2X6 FEMALE
J4-J86 J92-J121 J152-J181 J212-J391 = SparkFun-Connectors:CONN_01: Single connection point. Often used as Generic Header-pin footprint for 0.1 inch spaced/style header connections On any of the 0.1 inch spaced packages, you can populate with these: Break Away Headers - Straight <https://www.sparkfun.com/products/116> (PRT-00116) Break Away Male Headers - Right Angle <https://www.sparkfun.com/products/553> (PRT-00553) Female Headers <https://www.sparkfun.com/products/115> (PRT-00115) Break Away Headers - Machine Pin <https://www.sparkfun.com/products/117> (PRT-00117) Break Away Female Headers - Swiss Machine Pin <https://www.sparkfun.com/products/743> (PRT-00743) This device is also useful as a general connection point to wire up your design to another part of your project. Our various solder wires solder well into these plated through hole pads. Hook-Up Wire - Assortment (Stranded, 22 AWG) <https://www.sparkfun.com/products/11375> (PRT-11375) Hook-Up Wire - Assortment (Solid Core, 22 AWG) <https://www.sparkfun.com/products/11367> (PRT-11367) View the entire wire category on our website here <https://www.sparkfun.com/categories/141> Special notes: SMTSO-256-ET is a "flush mount" nut for a 4-40 screw. We mostly use this on specialty testbeds; it is a nice way to connect hardware to your PCB at an adjustable hieght. Also note, the SNAP packages are for using a snappable style connector. We sell a baggie of snaps and they are also used on two LilyPad designs: Snap Assortment - 30 pack (male and female) <https://www.sparkfun.com/products/11347> (DEV-11347) LilyPad Arduino SimpleSnap <https://www.sparkfun.com/products/10941> (DEV-10941) LilyPad SimpleSnap Protoboard <https://www.sparkfun.com/products/10940> (DEV-10940)
Q1 Q2 = SparkFun-DiscreteSemi:MOSFET-NCH: N-channel MOSFETs Voltage controlled devices that allow control of high current outputs. SparkFun Products: SparkFun OpenScale <https://www.sparkfun.com/products/13261> SparkFun Digital Sandbox <https://www.sparkfun.com/products/12651> SparkFun Monster Moto Shield <https://www.sparkfun.com/products/10182> SparkFun MOSFET Power Controller <https://www.sparkfun.com/products/11214>; PROD_ID: TRANS-00830; VALUE: 220mA/50V/3.5Ω
R1-R20 = rcl:R-EU_: RESISTOR, European symbol
S1 = switch-dil:DIP03YL: DIL/CODE SWITCH; OC_FARNELL: unknown; OC_NEWARK: unknown
U$1 = KIS-3R33S:KIS-3R33S: DC-DC Converter
WEMOS1 = esp8266modules:WEMOS-D1-MINI: WeMos.cc D1 mini ESP8266 module
X1 = con-3m:2534-: 3M (TM) Pak 100 4-Wall Header Source: 3M; OC_FARNELL: unknown; OC_NEWARK: unknown
X2 X3 = con-3m:2516-: 3M (TM) Pak 100 4-Wall Header Source: 3M; OC_FARNELL: unknown; OC_NEWARK: unknown
X4 X5 = con-phoenix-508:MSTBA2: PHOENIX; MF: FARNELL; MPN: 1757242; OC_FARNELL: 3705171; OC_NEWARK: 71C4161